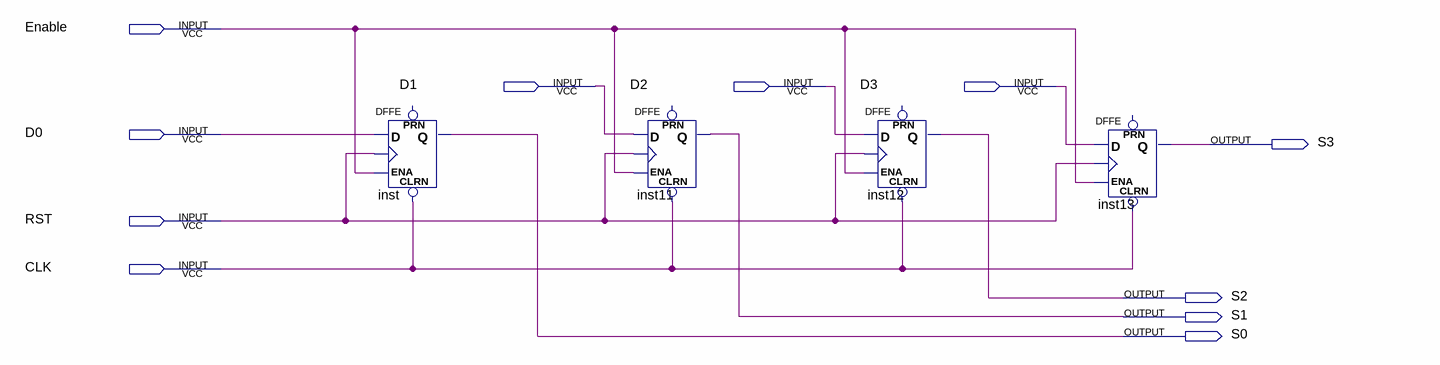
[diagram p0: schematic sheet]
// Quartus schematic Registro.bdf as structural Verilog: 4 symbols, 11 pins
module Registro (
  input  Enable,
  input  D1,
  input  D2,
  input  D3,
  input  D0,
  input  RST,
  input  CLK,
  output S3,
  output S2,
  output S1,
  output S0
);

  DFFE inst (.CLRN(CLK), .D(D0), .CLK(RST), .ENA(Enable), .Q(S0));  // open: PRN
  DFFE inst11 (.CLRN(CLK), .D(D1), .CLK(RST), .ENA(Enable), .Q(S1));  // open: PRN
  DFFE inst12 (.CLRN(CLK), .D(D2), .CLK(RST), .ENA(Enable), .Q(S2));  // open: PRN
  DFFE inst13 (.CLRN(CLK), .D(D3), .CLK(RST), .ENA(Enable), .Q(S3));  // open: PRN
endmodule
